# EAGLE design PA (EAGLE 7.7.0)
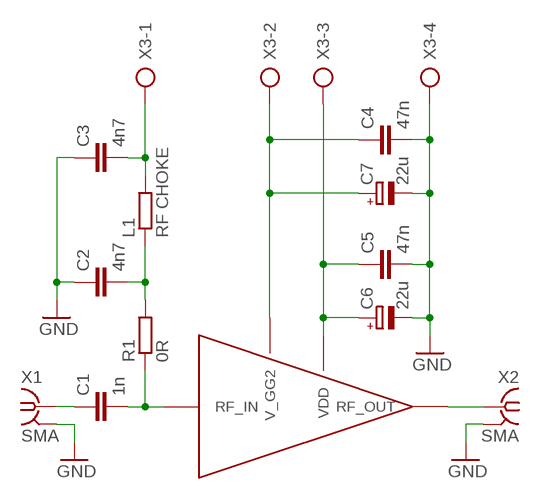
[diagram p0: schematic, sheet 1]

## Parts
C1  1n  C-EUC0805K  [C0805K]
C2  4n7  C-EUC0805K  [C0805K]
C3  4n7  C-EUC0805K  [C0805K]
C4  47n  C-EUC1206K  [C1206K]
C5  47n  C-EUC1206K  [C1206K]
C6  22u  CPOL-EU153CLV-1010  [153CLV-1010]
C7  22u  CPOL-EU153CLV-1010  [153CLV-1010]
L1  RF CHOKE  R-EU_R0805  [R0805]
R1  0R  R-EU_R0805  [R0805]
U$1  RA45H8994M1  [RF_MODULE]
X1  SMA  SMA-142-0701-801/806  [J502-ND-142-0701-801/806]
X2  SMA  SMA-142-0701-801/806  [J502-ND-142-0701-801/806]
X3  AK500/4  [AK500/4]

## Nets
GND [pwr]: C2.1 C3.1 C4.2 C5.2 C6.- C7.- X1.G@1 X1.G@2 X1.G@3 X1.G@4 X2.G@1 X2.G@2 X2.G@3 X2.G@4 X3.4
N$1: C1.1 X1.1
N$2: C1.2 R1.1 U$1.RF_IN
N$3 [rf_out]: U$1.RF_OUT X2.1
N$4 [pwr]: C2.2 L1.1 R1.2
N$5 [pwr]: C3.2 L1.2 X3.1
N$6 [pwr]: C4.1 C7.+ U$1.V_GG2 X3.2
N$7 [pwr]: C5.1 C6.+ U$1.VDD X3.3

## Library data of the parts
C1-C5 = rcl:C-EU: CAPACITOR, European symbol
C6 C7 = rcl:CPOL-EU: POLARIZED CAPACITOR, European symbol
L1 R1 = resistor:R-EU_: RESISTOR, European symbol
U$1 = RF_modules:RA45H8994M1
X1 X2 = con-coax:SMA-: SMA 50 Ohm End Launch Jack Receptacle - Round Contact Johnson Components Source: www.johnsoncomponents.com .. J502-ND.pdf; MF: JOHNSON COMPONENTS; MPN: 142-0701-801; OC_FARNELL: 1608592; OC_NEWARK: 90F2624
X3 = con-ptr500:AK500/4: CONNECTOR; OC_FARNELL: unknown; OC_NEWARK: unknown

## Net classes
0 rf_in: width 1 mm, drill 0.6 mm, clearance 0.2 mm
1 pwr: width 2 mm, drill 0.6 mm, clearance 0.2 mm
2 rf_out: width 1 mm, drill 0.6 mm, clearance 0.2 mm

## Board
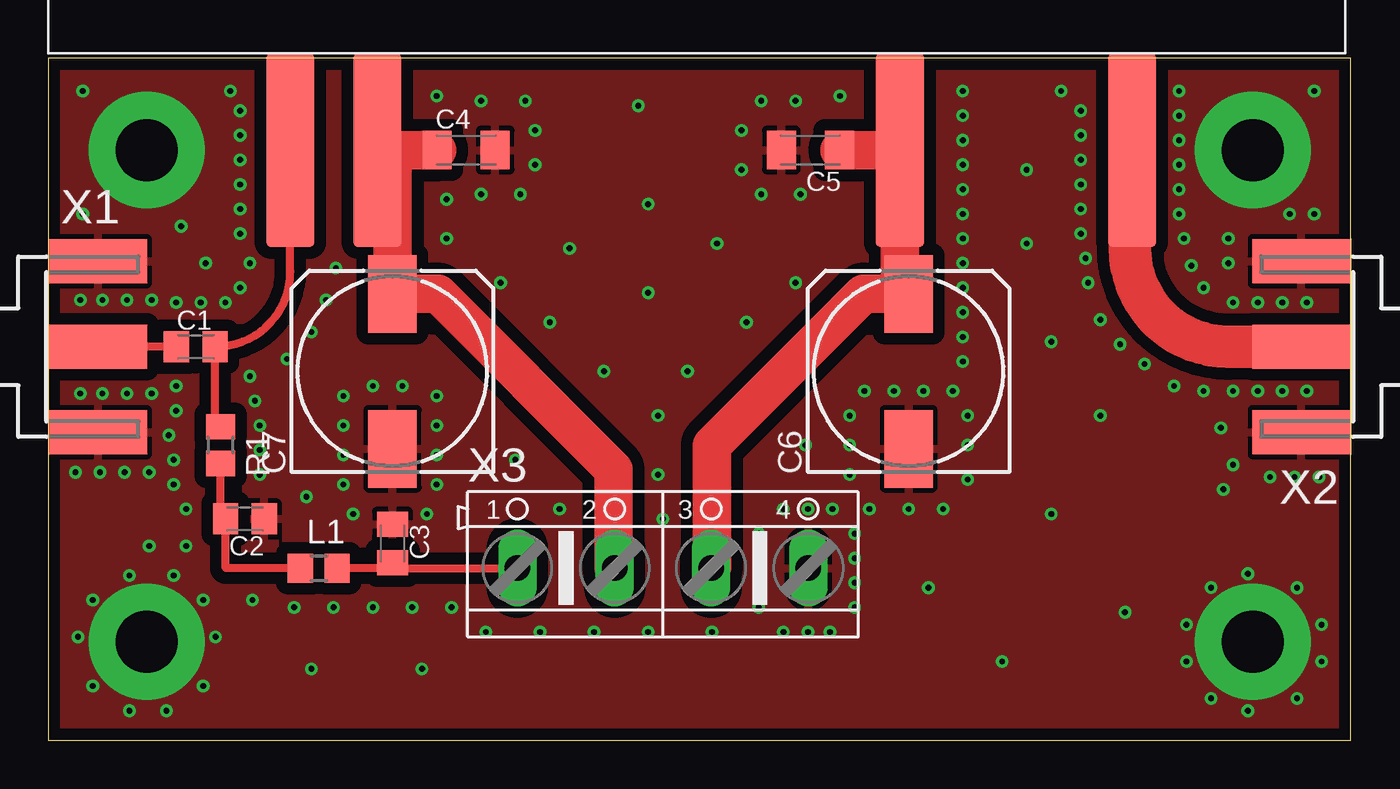
[diagram p1: board, top side]
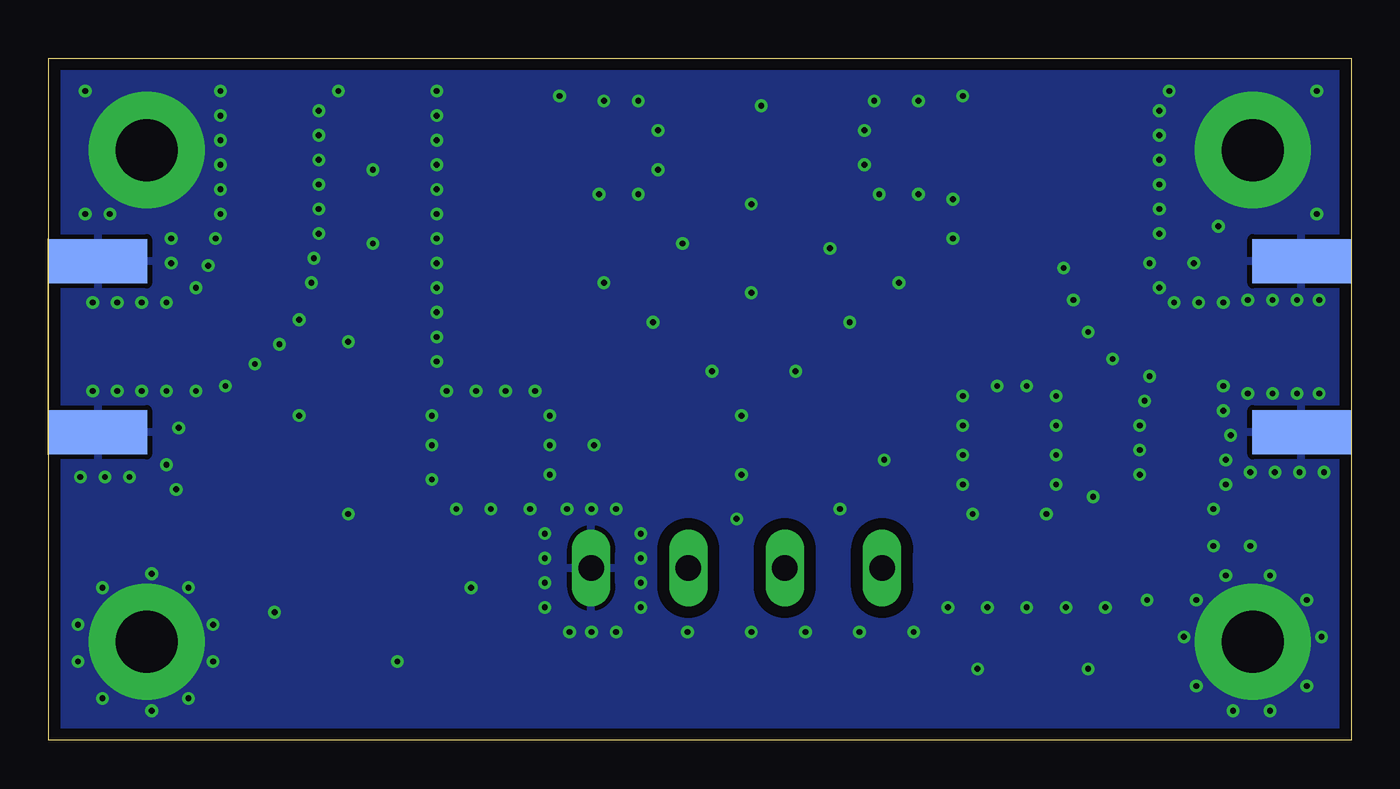
[diagram p2: board, bottom side, seen from below]

Size 67.31 x 35.23 mm. Coordinates in mm from the lower left corner, seen from the top.
Outline: 0,0 67.29,0 67.29,35.23 0,35.23 0,0
Copper layers (1*16): Top 0.0356mm / dielectric 1.5011mm / Bottom 0.0356mm
Design rules "Moje Technoservice 1 *": minimum track width 4mil, minimum drill 13mil, track to track 5mil, track to pad 5mil, pad to pad 5mil, via to via 5mil, smd to smd 5mil, copper to edge 15mil, drill to drill 6mil, minimum pad ring 7mil, minimum via ring 7mil, stop-mask expansion 3mil, vias tented up to drill 0.3mm, thermal gap 10mil

### Footprints (pad centres in the part's own frame; a part is rotated, then mirrored left to right if it is on the bottom)
C0805K = smd 1.3 x 1.6: 1 -1,0; 2 1,0
C1206K = smd 1.5 x 2: 1 -1.5,0; 2 1.5,0
153CLV-1010 = smd 4 x 2.5: + 4,0; - -4,0
R0805 = smd 1.3 x 1.5: 1 -0.95,0; 2 0.95,0
RF_MODULE = smd 2.5 x 10: RF_IN 12.5,0; RF_OUT 56,0; V_GG2 17,0; VDD 44,0
J502-ND-142-0701-801/806 = smd 5.08 x 2.286: 1 2.565,0; G@1 2.565,4.42; G@2 2.565,-4.42 | smd 5.08 x 2.286 bottom: G@3 2.565,4.42; G@4 2.565,-4.42
AK500/4 = drill 1.321 long: 1 -7.518,0; 2 -2.489,0; 3 2.489,0; 4 7.518,0

### Placement (x,y rotation side)
C1  7.62,20.32 0 top
C2  10.16,11.43 180 top
C3  17.78,10.16 270 top
C4  21.59,30.48 0 top
C5  39.37,30.48 180 top
C6  44.45,19.05 90 top
C7  17.78,19.05 90 top
L1  13.97,8.89 0 top
R1  8.89,15.24 270 top
U$1  0,30.48 0 top
X1  0,20.32 0 top
X2  67.31,20.32 180 top
X3  31.75,8.89 0 top

### Tracks (layer width: path | path; a pad name or v marks a point on that pad's centre or on a via)
GND  (via drill 0.3, 3.2 pad 6)
  other vias: 1.65,22.73 2.79,22.73 4.06,22.73 5.33,22.73 6.6,22.61 7.87,22.61 9.14,22.61 10.41,24.64 9.91,26.16 9.91,27.43 9.91,28.7 9.91,29.97 9.91,31.24 9.91,32.51 9.4,33.53 14.86,24.38 9.91,23.37 13.59,21.08 12.32,19.68 10.41,18.8 10.67,17.53 10.92,16.26 10.92,14.99 10.92,13.72 5.33,17.91 4.06,17.91 2.79,17.91 1.65,17.91 6.6,18.29 6.6,17.02 6.22,15.75 6.48,14.48 6.48,13.21 15.75,11.68 15.24,13.21 15.24,14.73 15.24,16.26 15.24,17.78 16.76,18.29 18.29,18.29 20.07,17.78 20.07,16.26 20.07,14.73 20.07,13.21 19.56,11.68 24.13,14.48 26.42,11.94 31.75,11.43 31.5,13.72 31.5,16.76 28.7,19.05 25.91,21.59 23.37,23.62 20.57,27.94 20.57,25.91 25.15,29.72 22.35,28.19 24.38,28.19 20.07,33.27 22.35,33.02 24.64,33.02 25.15,31.5 40.89,33.27 38.61,33.02 36.83,33.02 35.81,31.5 35.81,29.46 36.83,28.19 38.86,28.19 38.61,23.62 36.07,21.59 33.02,19.05 46.23,11.94 47.5,13.46 47.5,15.24 47.5,16.76 46.74,18.03 45.21,18.03 43.69,18.03 42.16,18.03 41.4,16.76 41.4,15.24 41.4,13.72 42.42,11.94 44.45,11.94 52.32,33.53 53.34,32.51 53.34,27.43 53.34,28.7 53.34,29.97 53.34,31.24 53.34,26.16 53.59,24.89 54.36,21.72 55.37,20.45 56.64,19.43 58.17,18.29 59.69,18.03 61.21,18.03 61.21,22.61 59.05,24.51 58.67,25.91 58.42,27.18 58.42,28.45 58.42,29.72 58.42,30.99 58.42,32.26 58.42,33.53 12.7,6.86 14.73,6.86 16.76,6.86 18.8,6.86 20.83,6.86 22.61,5.59 25.4,5.59 28.19,5.59 30.99,5.59 34.29,5.59 37.97,5.59 40.39,5.59 39.12,15.24 30.48,32.77 30.99,27.69 30.99,23.11 26.92,25.4 34.54,25.65 47.24,33.53 47.24,32.26 47.24,30.99 47.24,29.72 47.24,28.45 47.24,27.18 47.24,25.91 47.24,24.64 47.24,23.37 47.24,22.1 47.24,20.83 47.24,19.56 50.55,29.46 50.55,25.65 51.82,20.57 54.36,16.76 45.47,7.87 51.82,11.68 55.63,6.6 60.71,12.95 5.08,5.08 62.23,5.08 4.19,8.51 2.29,2.79 1.53,5.33 2.29,7.24 6.48,8.51 8,7.24 8.64,5.33 8,2.79 61.98,8.6 49.28,4.06 64.52,7.87 58.8,5.97 58.8,4.06 60.07,2.16 60.07,7.88 36.7,6.86 36.7,8.13 36.7,9.4 36.7,10.67 39.24,11.94 41.66,6.86 41.66,8.13 41.66,9.4 41.66,10.67 40.51,11.94 37.97,11.94 39.24,5.59 62.48,22.61 63.75,22.61 65.02,22.61 62.48,18.03 63.75,18.03 65.02,18.03 7.11,11.94 7.11,10.03 5.21,10.03 13.34,12.57 10.54,7.24 59.69,23.37 65.41,33.53 14.35,22.73 13.59,3.68 19.3,3.68 61.98,1.52 64.52,2.16 65.79,4.06 65.79,5.97 4.19,1.52 6.1,1.52 5.08,30.48 62.23,30.48 53.72,23.62 3.94,13.84 5.21,13.84 6.86,26.54 8.13,24.64 1.78,27.18 1.78,33.53 60.96,25.91 65.41,27.18 60.58,16.13 63.12,13.59 65.66,13.59 64.39,13.59 61.21,14.22 60.96,24.64 64.14,27.18 1.4,13.84 2.67,13.84
  pour Top (isolate 0.61): 0,35.56 67.31,35.56 67.31,0 0,0
  pour Bottom (isolate 0.61): 0,35.81 0,0 67.31,0 67.31,35.81
N$1
  Top 0.406: C1.1 X1.1
N$2
  Top 0.406: R1.1 8.62,16.19 C1.2 arc90 12.5,24.2 U$1.RF_IN
N$3
  Top 2.184: X2.1 60.96,20.32 arc-90 55.88,25.4 55.88,30.36 arc-90 U$1.RF_OUT
N$4
  Top 0.406: L1.1 9.16,8.89 C2.2 8.89,11.43 R1.2
N$5
  Top 0.406: L1.2 17.51,8.89 arc90 C3.2 arc90 18.05,8.89 X3.1
N$6
  Top 0.406: 29.21,8.94 X3.2 | 17.78,29.7 17,29.7 U$1.V_GG2
  Top 2: U$1.V_GG2 C4.1 | 17.78,29.7 C7.+ 20.13,23.05 29.21,13.97 29.21,8.94
N$7
  Top 0.406: 44,23.5 C6.+ | 34.29,8.94 X3.3
  Top 2: C5.1 U$1.VDD 44,23.5 | C6.+ 42.1,23.05 34.29,15.24 34.29,8.94

### Text on the board
tDocu: TELETRA | 900MHz PA BOARD | VGG1|VGG2 | VDD GND